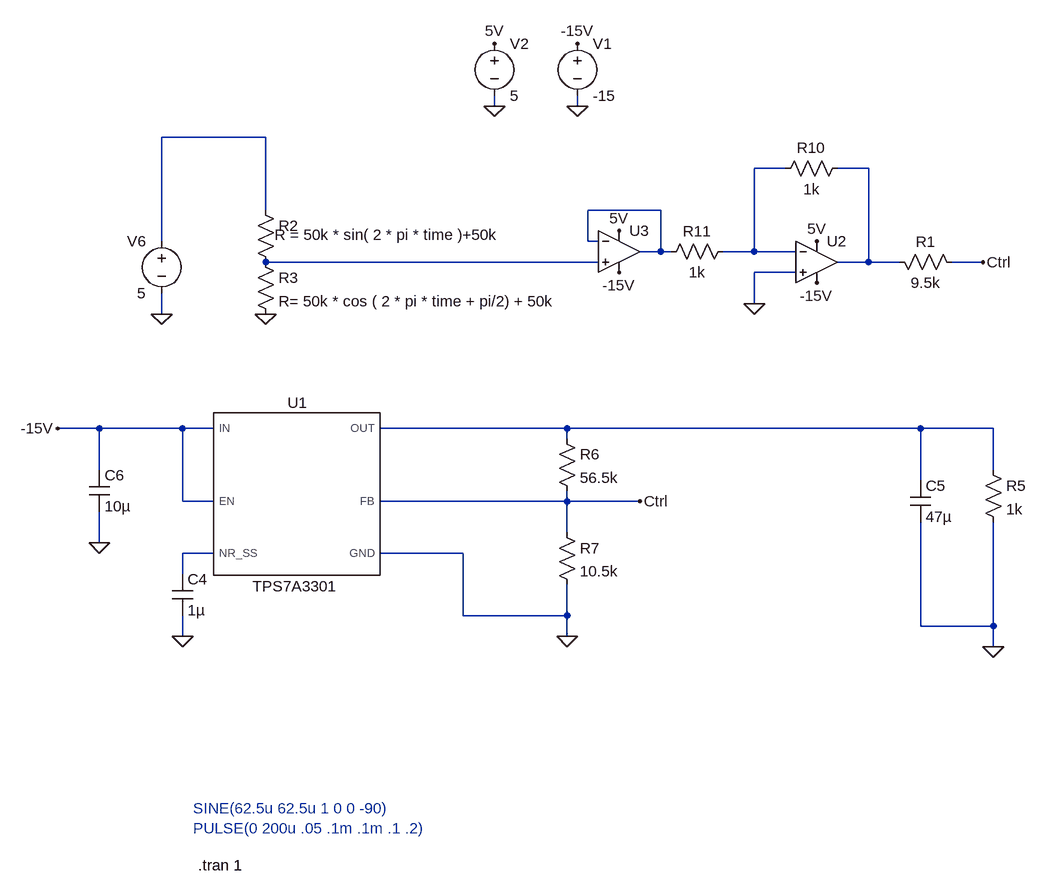
[diagram p0: schematic outputControl_TPS7A3301.asc]
outputControl_TPS7A3301.asc, the LTspice schematic file:
Version 4.1
SHEET 1 2760 1148
WIRE 912 -960 912 -976
WIRE 1040 -960 1040 -976
WIRE 560 -912 400 -912
WIRE 1360 -864 1312 -864
WIRE 1488 -864 1440 -864
WIRE 560 -800 560 -912
WIRE 1168 -800 1056 -800
WIRE 400 -752 400 -912
WIRE 1056 -752 1056 -800
WIRE 1072 -752 1056 -752
WIRE 1168 -736 1168 -800
WIRE 1168 -736 1136 -736
WIRE 1184 -736 1168 -736
WIRE 1312 -736 1312 -864
WIRE 1312 -736 1264 -736
WIRE 1376 -736 1312 -736
WIRE 1072 -720 560 -720
WIRE 1488 -720 1488 -864
WIRE 1488 -720 1440 -720
WIRE 1536 -720 1488 -720
WIRE 1664 -720 1616 -720
WIRE 1376 -704 1312 -704
WIRE 1312 -656 1312 -704
WIRE 400 -640 400 -672
WIRE 304 -464 240 -464
WIRE 432 -464 304 -464
WIRE 480 -464 432 -464
WIRE 1024 -464 736 -464
WIRE 1568 -464 1024 -464
WIRE 1680 -464 1568 -464
WIRE 1024 -448 1024 -464
WIRE 304 -400 304 -464
WIRE 1680 -400 1680 -464
WIRE 1568 -384 1568 -464
WIRE 432 -352 432 -464
WIRE 480 -352 432 -352
WIRE 1024 -352 1024 -368
WIRE 1024 -352 736 -352
WIRE 1136 -352 1024 -352
WIRE 1024 -304 1024 -352
WIRE 304 -288 304 -336
WIRE 480 -272 432 -272
WIRE 864 -272 736 -272
WIRE 432 -240 432 -272
WIRE 864 -176 864 -272
WIRE 1024 -176 1024 -224
WIRE 1024 -176 864 -176
WIRE 1568 -160 1568 -320
WIRE 1680 -160 1680 -320
WIRE 1680 -160 1568 -160
WIRE 432 -144 432 -176
WIRE 1024 -144 1024 -176
WIRE 1680 -128 1680 -160
FLAG 1040 -960 0
FLAG 1040 -1056 -15V
FLAG 912 -960 0
FLAG 912 -1056 5V
FLAG 240 -464 -15V
FLAG 432 -144 0
FLAG 1680 -128 0
FLAG 1024 -144 0
FLAG 304 -288 0
FLAG 1312 -656 0
FLAG 1664 -720 Ctrl
FLAG 1136 -352 Ctrl
FLAG 560 -640 0
FLAG 400 -640 0
FLAG 1408 -752 5V
FLAG 1104 -768 5V
FLAG 1408 -688 -15V
FLAG 1104 -704 -15V
SYMBOL voltage 1040 -1072 R0
WINDOW 123 0 0 Left 0
WINDOW 39 0 0 Left 0
SYMATTR InstName V1
SYMATTR Value -15
SYMBOL voltage 912 -1072 R0
WINDOW 123 0 0 Left 0
WINDOW 39 0 0 Left 0
SYMATTR InstName V2
SYMATTR Value 5
SYMBOL cap 416 -240 R0
SYMATTR InstName C4
SYMATTR Value 1µ
SYMBOL res 1664 -416 R0
SYMATTR InstName R5
SYMATTR Value 1k
SYMBOL res 1008 -464 R0
SYMATTR InstName R6
SYMATTR Value 56.5k
SYMBOL res 1008 -320 R0
SYMATTR InstName R7
SYMATTR Value 10.5k
SYMBOL cap 1552 -384 R0
SYMATTR InstName C5
SYMATTR Value 47µ
SYMBOL cap 288 -400 R0
SYMATTR InstName C6
SYMATTR Value 10µ
SYMBOL res 1456 -880 R90
WINDOW 0 0 56 VBottom 2
WINDOW 3 32 56 VTop 2
SYMATTR InstName R10
SYMATTR Value 1k
SYMBOL res 1280 -752 R90
WINDOW 0 0 56 VBottom 2
WINDOW 3 32 56 VTop 2
SYMATTR InstName R11
SYMATTR Value 1k
SYMBOL TPS7A3301 560 -432 R0
SYMATTR InstName U1
SYMBOL voltage 400 -768 M0
WINDOW 123 0 0 Left 0
WINDOW 39 0 0 Left 0
SYMATTR InstName V6
SYMATTR Value 5
SYMBOL res 1520 -736 M90
WINDOW 0 0 56 VBottom 2
WINDOW 3 32 56 VTop 2
SYMATTR InstName R1
SYMATTR Value 9.5k
SYMBOL res 544 -816 R0
WINDOW 3 30 54 Left 2
SYMATTR InstName R2
SYMATTR Value R = 50k * sin( 2 * pi * time )+50k
SYMBOL res 544 -736 R0
SYMATTR InstName R3
SYMATTR Value R= 50k * cos ( 2 * pi * time + pi/2) + 50k
SYMBOL OpAmps\\UniversalOpAmp 1408 -720 R0
SYMATTR InstName U2
SYMBOL OpAmps\\UniversalOpAmp 1104 -736 R0
SYMATTR InstName U3
TEXT 448 120 Left 2 ;SINE(62.5u 62.5u 1 0 0 -90)\nPULSE(0 200u .05 .1m .1m .1 .2)
TEXT 456 208 Left 2 !.tran 1

The netlist it stands for:
* outputControl_TPS7A3301.asc
V1 -15V 0 -15
V2 5V 0 5
C4 N007 0 1µ
R5 N006 0 1k
R6 N006 Ctrl 56.5k
R7 Ctrl 0 10.5k
C5 N006 0 47µ
C6 -15V 0 10µ
R10 N003 N002 1k
R11 N002 N004 1k
X§U1 -15V -15V N007 0 Ctrl N006 TPS7A3301  ; pins IN EN NR_SS GND FB OUT
V6 N001 0 5
R1 N003 Ctrl 9.5k
R2 N001 N005 R = 50k * sin( 2 * pi * time )+50k
R3 N005 0 R= 50k * cos ( 2 * pi * time + pi/2) + 50k
X§U2 0 N002 5V -15V N003 level1 Avol=1Meg GBW=10Meg Vos=0 En=0 Enk=0 In=0 Ink=0 Rin=500Meg  ; pins In+ In- V+ V- OUT
X§U3 N005 N004 5V -15V N004 level1 Avol=1Meg GBW=10Meg Vos=0 En=0 Enk=0 In=0 Ink=0 Rin=500Meg  ; pins In+ In- V+ V- OUT
* SINE(62.5u 62.5u 1 0 0 -90)
* PULSE(0 200u .05 .1m .1m .1 .2)
.tran 1
.lib TPS7A3301.lib
.lib UniversalOpAmp1.lib
.backanno
.end